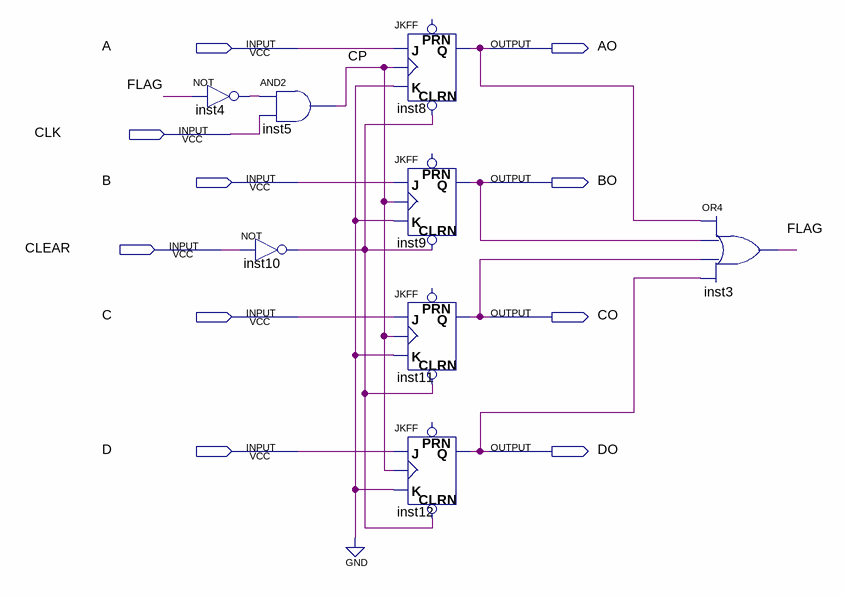
[diagram p0: schematic sheet]
// Quartus schematic suocun.bdf as structural Verilog: 8 symbols, 10 pins
module suocun (
  input  A,
  input  CLK,
  input  B,
  input  CLEAR,
  input  C,
  input  D,
  output AO,
  output BO,
  output CO,
  output DO
);

  wire CP, FLAG, inst4_out, inst10_out;

  not inst4 (inst4_out, FLAG);
  and inst5 (CP, inst4_out, CLK);
  not inst10 (inst10_out, CLEAR);
  JKFF inst8 (.CLRN(inst10_out), .K(1'b0), .J(A), .CLK(CP), .Q(AO));  // open: PRN
  JKFF inst9 (.CLRN(inst10_out), .K(1'b0), .J(B), .CLK(CP), .Q(BO));  // open: PRN
  JKFF inst11 (.CLRN(inst10_out), .K(1'b0), .J(C), .CLK(CP), .Q(CO));  // open: PRN
  JKFF inst12 (.CLRN(inst10_out), .K(1'b0), .J(D), .CLK(CP), .Q(DO));  // open: PRN
  or inst3 (FLAG, AO, BO, CO, DO);
endmodule
